# EAGLE design RPi-HAT_BUS-Controller_V0.2 (EAGLE 7.4.0)
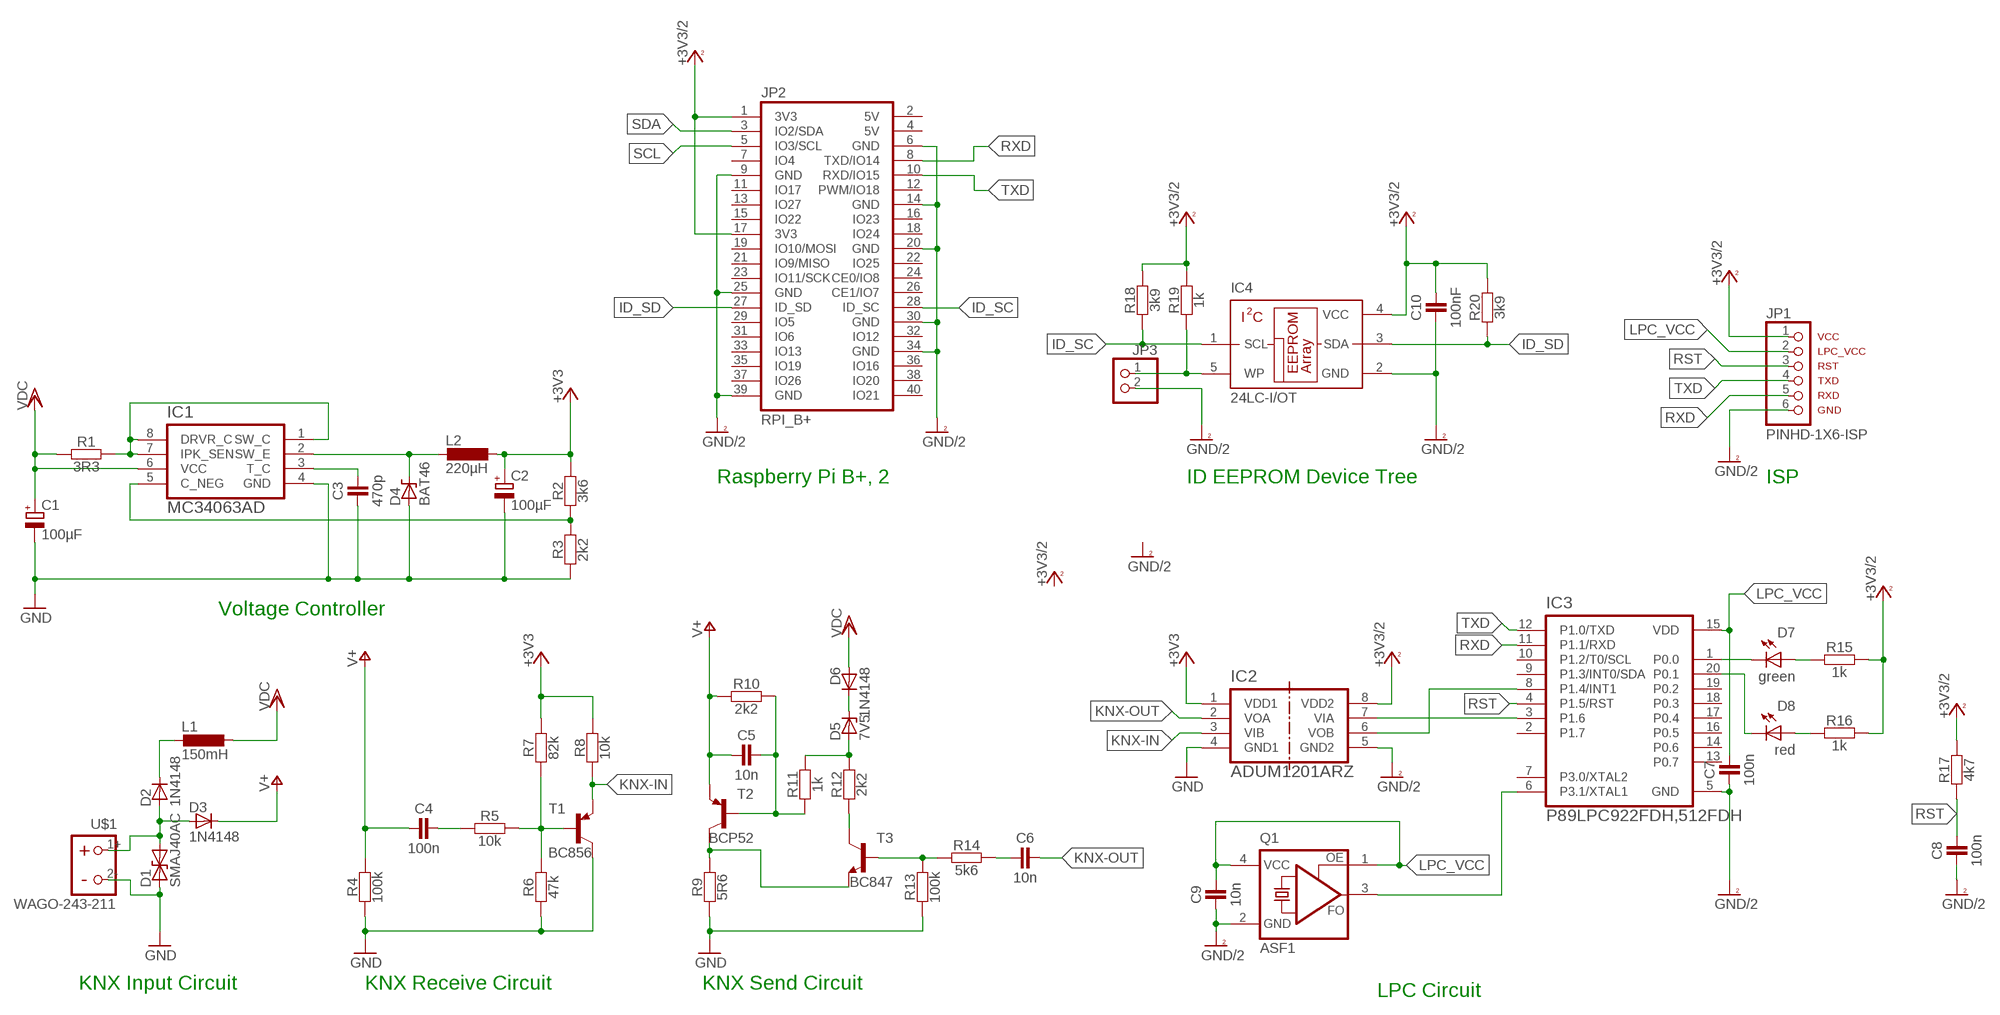
[diagram p0: schematic, sheet 1]

## Parts
C1  100µF  100µF,35V  [PANASONIC_D]
C2  100µF  100µF,6.3V  [PANASONIC_C]
C3  470p  CAPACITORC1206  [R1206]
C4  100n  CAPACITORC1206  [R1206]
C5  10n  CAPACITORC1206  [R1206]
C6  10n  CAPACITORC1206  [R1206]
C7  100n  CAPACITORC1206  [R1206]
C8  100n  CAPACITORC1206  [R1206]
C9  10n  CAPACITORC1206  [R1206]
C10  100nF  CAPACITORC1206  [R1206]
D1  SMAJ40AC  [DO-214AC]
D2  1N4148  1N4148MINIMELF  [MINIMELF]
D3  1N4148  1N4148MINIMELF  [MINIMELF]
D4  BAT46  [MINIMELF]
D5  7V5  Z-DIODE  [MINIMELF]
D6  1N4148  1N4148MINIMELF  [MINIMELF]
D7  green  LED1206  [CHIPLED_1206]
D8  red  LED1206  [CHIPLED_1206]
IC1  MC34063AD  [SOIC127P600X175-8N]
IC2  ADUM1201ARZ  [SOIC127P600X175-8N]
IC3  P89LPC922FDH,512FDH  [SOP65P640X110-20N]
IC4  24LC-I/OT  [SOT23-5]
JP1  PINHD-1X6-ISP  [1X06]
JP2  RPI_B+  [RPI-B+HAT]
JP3  PINHD-1X2  [1X02]
L1  150mH  150MH-L11PL1  [11P-L1]
L2  220µH  220µH-SMCC11.43  [2200-11.43]
Q1  ASF1  [ASF]
R1  3R3  RESISTORR1206  [R1206]
R2  3k6  RESISTORR1206  [R1206]
R3  2k2  RESISTORR1206  [R1206]
R4  100k  RESISTORR1206  [R1206]
R5  10k  RESISTORR1206  [R1206]
R6  47k  RESISTORR1206  [R1206]
R7  82k  RESISTORR1206  [R1206]
R8  10k  RESISTORR1206  [R1206]
R9  5R6  RESISTORR1206  [R1206]
R10  2k2  RESISTORR1206  [R1206]
R11  1k  RESISTORR1206  [R1206]
R12  2k2  RESISTORR1206  [R1206]
R13  100k  RESISTORR1206  [R1206]
R14  5k6  RESISTORR1206  [R1206]
R15  1k  RESISTORR1206  [R1206]
R16  1k  RESISTORR1206  [R1206]
R17  4k7  RESISTORR1206  [R1206]
R18  3k9  RESISTORR1206  [R1206]
R19  1k  RESISTORR1206  [R1206]
R20  3k9  RESISTORR1206  [R1206]
T1  BC856  PNPBC856  [SOT23]
T2  BCP52  PNPBCP52  [SOT223]
T3  BC847  NPN-BC847  [SOT23]
U$1  WAGO-243-211  [WAGO-243-211]

## Nets
+3V3: C2.+ IC2.1(VDD1) L2.1 R2.2 R7.2 R8.2
+3V3/2: C10.2 IC2.8(VDD2) IC4.4(VCC) JP1.1 JP2.1(3V3) JP2.17(3V3) R15.2 R16.2 R17.2 R18.2 R19.2 R20.2
GND: C1.- C2.- C3.1 D1.A D4.A IC1.4(GND) IC2.4(GND1) R3.1 R4.1 R6.1 R9.1 R13.1 T1.3(C) U$1.2-
GND/2: C7.1 C8.1 C9.1 C10.1 IC2.5(GND2) IC3.5(GND) IC4.2(GND) JP1.6 JP2.6(GND) JP2.9(GND) JP2.14(GND) JP2.20(GND) JP2.25(GND) JP2.30(GND) JP2.34(GND) JP2.39(GND) JP3.2 Q1.2(GND)
ID_SC: IC4.1(SCL) JP2.28(ID_SC) R18.1
ID_SD: IC4.3(SDA) JP2.27(ID_SD) R20.1
KNX-IN: IC2.3(VIB) R8.1 T1.2(E)
KNX-OUT: C6.2 IC2.2(VOA)
LPC_VCC: C7.2 C9.2 IC3.15(VDD) JP1.2 Q1.1(OE) Q1.4(VCC)
N$1: D1.C D2.A D3.A U$1.1+
N$3: IC1.5(C_NEG) R2.1 R3.2
N$4: C4.2 R5.1
N$5: D2.C L1.2
N$6: R5.2 R6.2 R7.1 T1.1(B)
N$8: IC1.1(SW_C) IC1.7(IPK_SEN) IC1.8(DRVR_C) R1.2
N$10: C3.2 IC1.3(T_C)
N$12: IC4.5(WP) JP3.1 R19.1
N$13: D4.C IC1.2(SW_E) L2.2
N$14: IC2.7(VIA) IC3.3(P1.6)
N$23: R9.2 T2.2(C) T2.4(C) T3.2(E)
N$24: C5.2 R10.2 R11.1 T2.1(B)
N$25: D5.A R11.2 R12.2
N$26: R12.1 T3.3(C)
N$28: R13.2 R14.1 T3.1(B)
N$29: C6.1 R14.2
N$31: D5.C D6.C
N$32: IC3.6(P3.1/XTAL1) Q1.3(FO)
N$33: IC2.6(VOB) IC3.8(P1.4/INT1)
N$34: D7.C IC3.1(P0.0)
N$35: D7.A R15.1
N$37: D8.C IC3.20(P0.1)
N$38: D8.A R16.1
RST: C8.2 IC3.4(P1.5/RST) JP1.3 R17.1
RXD: IC3.11(P1.1/RXD) JP1.5 JP2.8(TXD/IO14)
SCL: JP2.5(IO3/SCL)
SDA: JP2.3(IO2/SDA)
TXD: IC3.12(P1.0/TXD) JP1.4 JP2.10(RXD/IO15)
V+: C4.1 C5.1 D3.C R4.2 R10.1 T2.3(E)
VDD: C1.+ D6.A IC1.6(VCC) L1.1 R1.1 ; supply symbol labelled VDC
Unconnected: IC3.2(P1.7) IC3.7(P3.0/XTAL2) IC3.9(P1.3/INT0/SDA) IC3.10(P1.2/T0/SCL) IC3.13(P0.7) IC3.14(P0.6) IC3.16(P0.5) IC3.17(P0.4) IC3.18(P0.3) IC3.19(P0.2) JP2.2(5V) JP2.4(5V) JP2.7(IO4) JP2.11(IO17) JP2.12(PWM/IO18) JP2.13(IO27) JP2.15(IO22) JP2.16(IO23) JP2.18(IO24) JP2.19(IO10/MOSI) JP2.21(IO9/MISO) JP2.22(IO25) JP2.23(IO11/SCK) JP2.24(CE0/IO8) JP2.26(CE1/IO7) JP2.29(IO5) JP2.31(IO6) JP2.32(IO12) JP2.33(IO13) JP2.35(IO19) JP2.36(IO16) JP2.37(IO26) JP2.38(IO20) JP2.40(IO21)

## Notes on the sheet
- Raspberry Pi B+, 2 | ID EEPROM Device Tree | ISP
- Voltage Controller
- KNX Input Circuit | KNX Receive Circuit | KNX Send Circuit
- LPC Circuit

## Library data of the parts
C1 = RCL_for_Selfbus-Projects:100µF,35V: Polarized Capacitor 100µF, 35V
C2 = RCL_for_Selfbus-Projects:100µF,6.3V: Polarized Capacitor 100µF, 6.3V
C3-C10 = RCL_for_Selfbus-Projects:CAPACITOR: Capacitor
D1 = Diode:SMAJ40AC
D2 D3 = Diode:1N4148
D4 = Diode_for_Selfbus-Projects:BAT46: Schottky Diode
D5 = Diode_for_Selfbus-Projects:Z-DIODE: Z-Diode
D6 = Diode_for_Selfbus-Projects:1N4148: Diode
D7 D8 = Diode_for_Selfbus-Projects:LED: LED
IC1 = IC_for_Selfbus-Projects:MC34063A: DC/DC converter control circuit
IC2 = IC_for_Selfbus-Projects:ADUM1201ARZ: Dual-Channel Digital Isolators; MPN: ADUM1201ARZ; OC_FARNELL: 1078200; OC_NEWARK: 19M0753; PACKAGE: SOIC-8; SUPPLIER: Analog Devices
IC3 = IC_for_Selfbus-Projects:P89LPC922FDH,512: 8-bit microcontrollers with two-clock 80C51 core 2 kB/4 kB/8 kB 3 V low-power Flash with 256-byte data RAM; MPN: P89LPC922FDH,512; OC_FARNELL: 1895067; OC_NEWARK: 70R8570; PACKAGE: TSSOP-20; SUPPLIER: NXP
IC4 = IC_for_Selfbus-Projects:24LC*: Microchip I2C EEPROM 2 Kbit - 24LC02B - 24LC02BT-I/OTDKR-ND 32 Kbit- 24LC32A - 24LC32AT-I/OTDKR-ND; DIGIKEY: 24LC32AT-I/OTDKR-ND
JP1 = Connector_for_Selfbus-Projects:PINHD-1X6-ISP: PIN HEADER - ISP for Selfbus-Controller
JP2 = Connector_for_Selfbus-Projects:RPI_B+: RPi-B+ und RPi-B2 HAT
JP3 = Connector_for_Selfbus-Projects:PINHD-1X2: PIN HEADER
L1 = RCL_for_Selfbus-Projects:150MH-L11P: Inductor 150mH
L2 = RCL_for_Selfbus-Projects:220µH-SMCC: Inductor 220µH
Q1 = IC_for_Selfbus-Projects:ASF*: CRYSTAL CLOCK OSCILLATORS 5.0 Vdc or 3.3 Vdc - LOW PROFILE ULTRA MINIATURE CERAMIC SURFACE MOUNT Source: http://www.abracon.com/Oscillators/asf1-L-L1.pdf; OC_FARNELL: unknown; OC_NEWARK: unknown
R1-R20 = RCL_for_Selfbus-Projects:RESISTOR: Resistor
T1 T2 = Transistor_for_Selfbus-Projects:PNP: PNP Transistor
T3 = Transistor_for_Selfbus-Projects:NPN: NPN Transistor
U$1 = Connector_for_Selfbus-Projects:WAGO-243-211: WAGO KNX-Busklemme

## Board
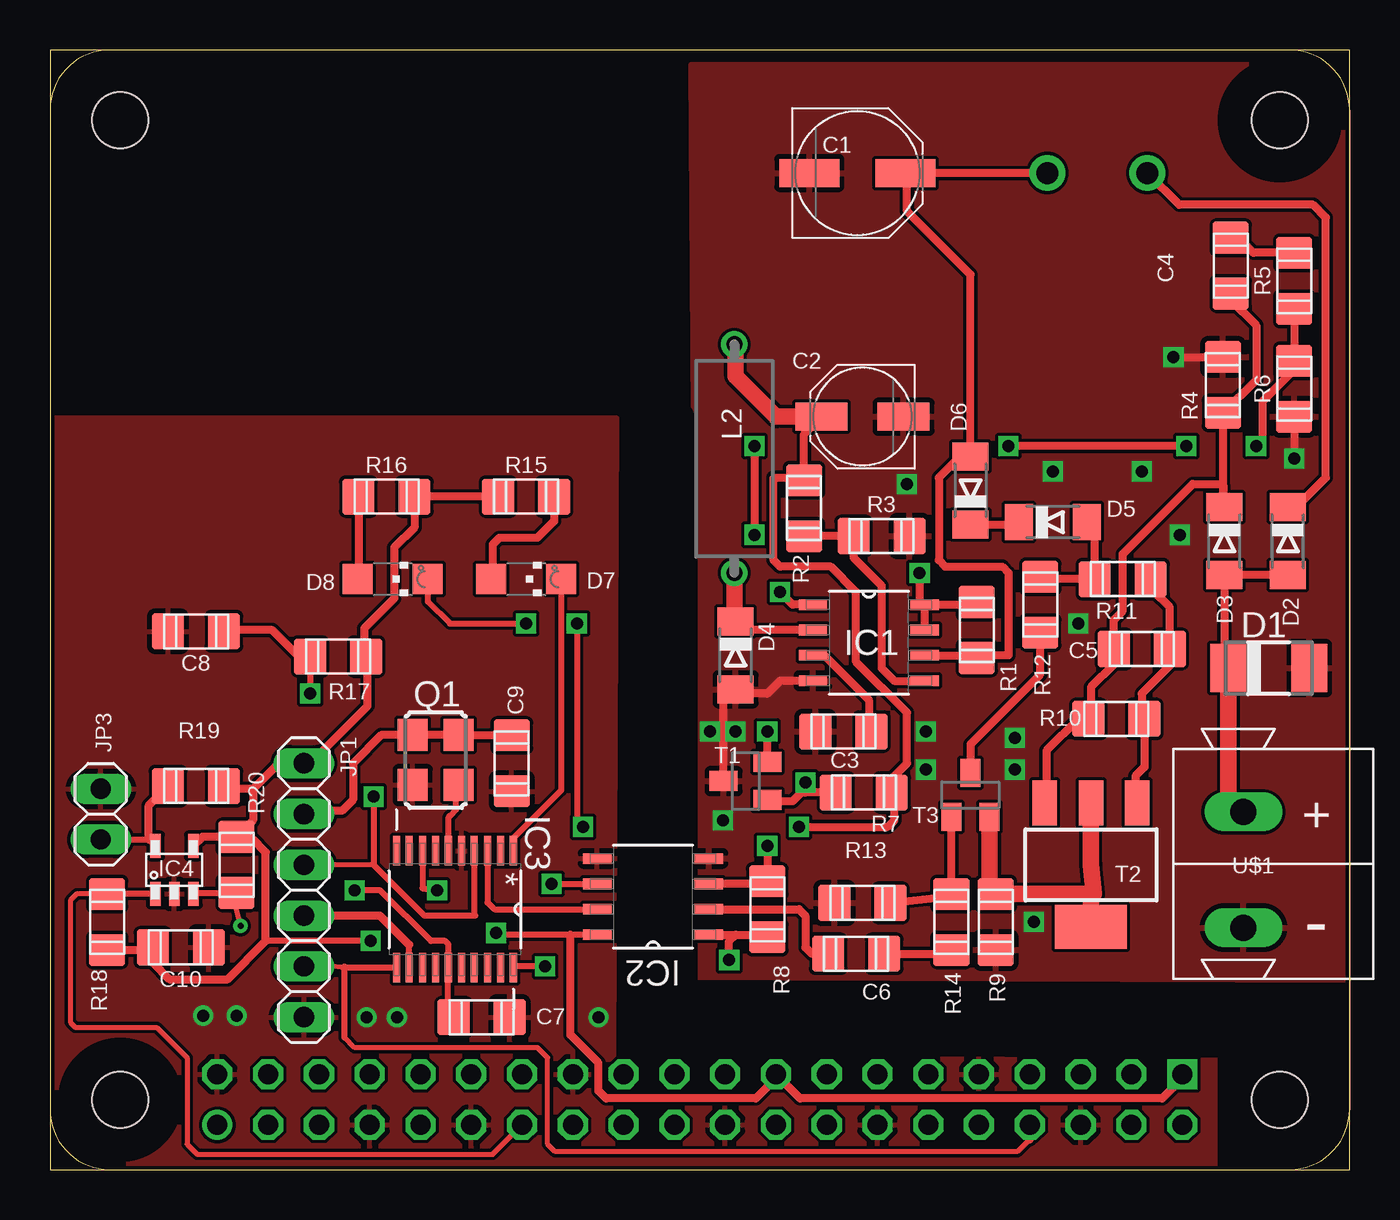
[diagram p1: board, top side]
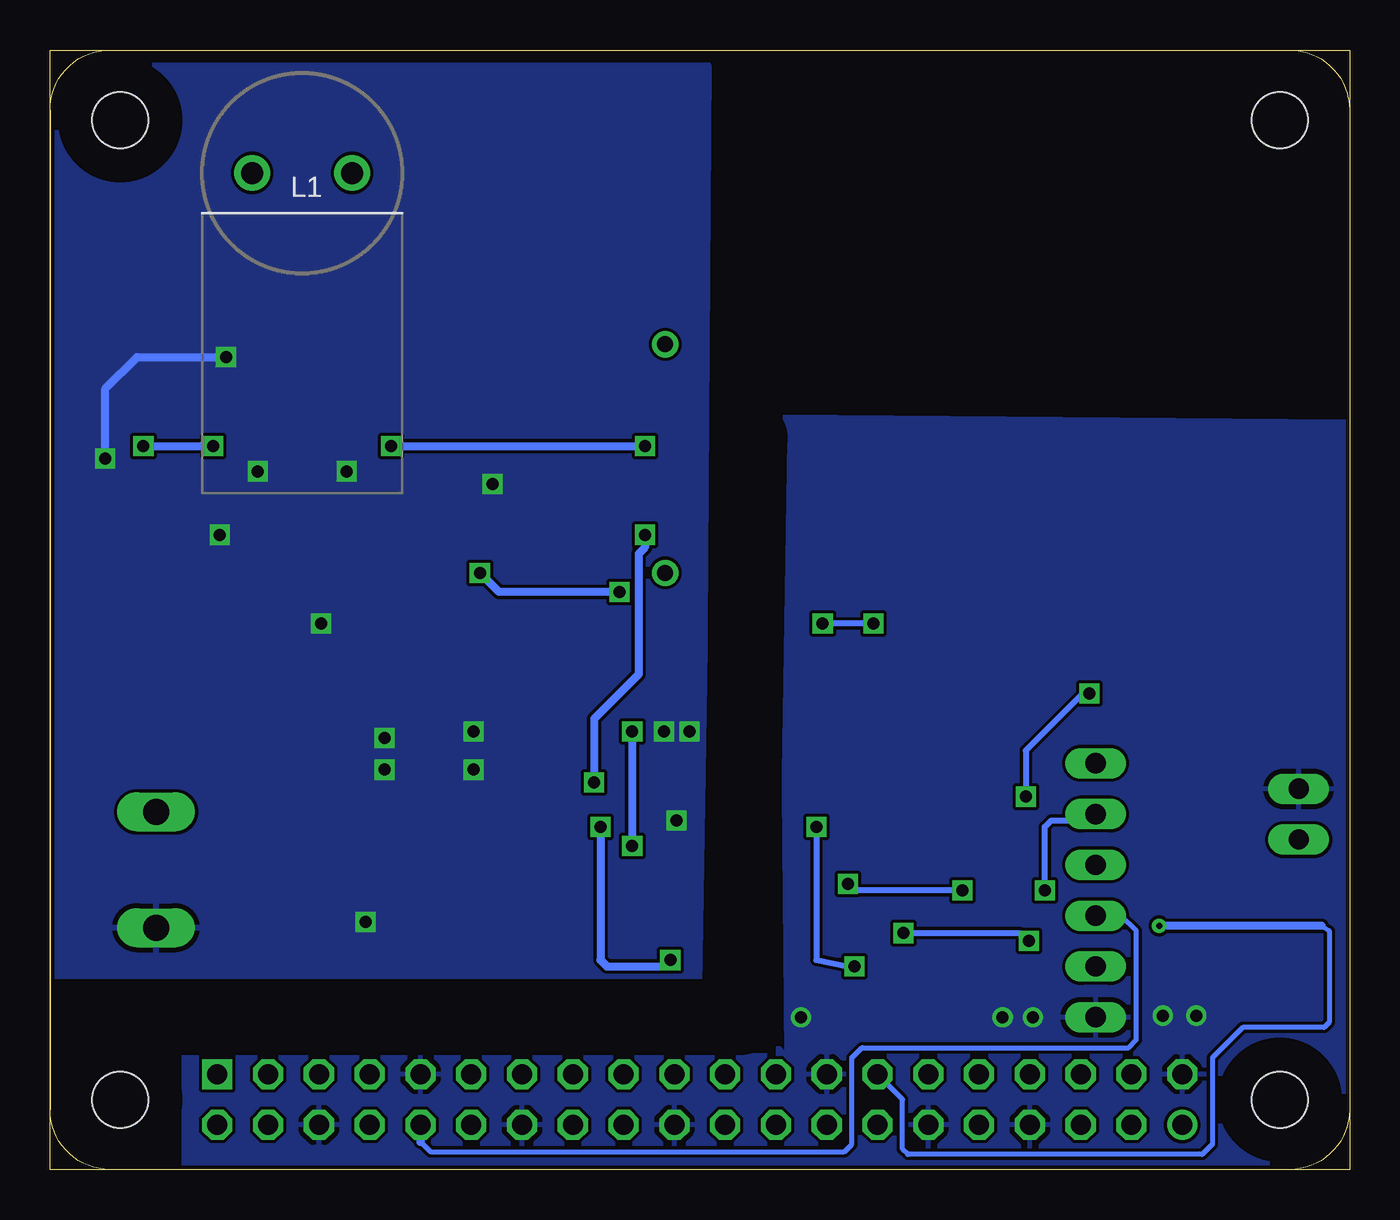
[diagram p2: board, bottom side, seen from below]

Size 65 x 56 mm. Coordinates in mm from the lower left corner, seen from the top.
Outline: 0,0 65,0 65,56 0,56 0,0
Copper layers (1*16): Top 0.035mm / dielectric 1.5mm / Bottom 0.035mm
Design rules "default *": minimum track width 8mil, minimum drill 0.3mm, track to track 6.5mil, track to pad 6.5mil, pad to pad 6.5mil, via to via 6.5mil, smd to smd 1mil, copper to edge 8mil, drill to drill 8mil, minimum pad ring 10mil, minimum via ring 8mil, stop-mask expansion 4mil, vias tented up to drill 0mil, thermal gap 10mil
tRestrict: 2 lines
bRestrict: 2 lines

### Footprints (pad centres in the part's own frame; a part is rotated, then mirrored left to right if it is on the bottom)
PANASONIC_D = smd 3 x 1.4: + 2.4,0; - -2.4,0
PANASONIC_C = smd 2.6 x 1.4: + 2.05,0; - -2.05,0
R1206 = smd 1.8 x 1.6: 1 0,1.4; 2 0,-1.4
DO-214AC = smd 1.8 x 2.4: A 2.025,0; C -2.025,0
MINIMELF = smd 1.4 x 1.8: A 1.7,0; C -1.7,0
CHIPLED_1206 = smd 1.5 x 1.5: A -1.75,0; C 1.75,0
SOIC127P600X175-8N = smd 1.422 x 0.533: 1 -2.794,1.27; 2 -2.794,0; 3 -2.794,-1.27; 4 -2.794,-2.54; 5 2.794,-2.54; 6 2.794,-1.27; 7 2.794,0; 8 2.794,1.27
SOP65P640X110-20N = smd 1.473 x 0.356: 1 -2.286,2.54; 2 -2.286,1.905; 3 -2.286,1.245; 4 -2.286,0.584; 5 -2.286,-0.051; 6 -2.286,-0.711; 7 -2.286,-1.346; 8 -2.286,-2.007; 9 -2.286,-2.667; 10 -2.286,-3.302; 11 3.556,-3.302; 12 3.556,-2.667; 13 3.556,-2.007; 14 3.556,-1.346; 15 3.556,-0.711; 16 3.556,-0.051; 17 3.556,0.584; 18 3.556,1.245; 19 3.556,1.905; 20 3.556,2.54
SOT23-5 = smd 1.2 x 0.6: 1 -1.2,0.95; 2 -1.2,0; 3 -1.2,-0.95; 4 1.2,-0.95; 5 1.2,0.95
1X06 = drill 1.016 long: 1 -6.35,0; 2 -3.81,0; 3 -1.27,0; 4 1.27,0; 5 3.81,0; 6 6.35,0
RPI-B+HAT = drill 1 square: 1 56.63,4.77 | drill 1 octagon: 2 56.63,2.23; 3 54.09,4.77; 4 54.09,2.23; 5 51.55,4.77; 6 51.55,2.23; 7 49.01,4.77; 8 49.01,2.23; 9 46.47,4.77; 10 46.47,2.23; 11 43.93,4.77; 12 43.93,2.23; 13 41.39,4.77; 14 41.39,2.23; 15 38.85,4.77; 16 38.85,2.23; 17 36.31,4.77; 18 36.31,2.23; 19 33.77,4.77; 20 33.77,2.23; 21 31.23,4.77; 22 31.23,2.23; 23 28.69,4.77; 24 28.69,2.23; 25 26.15,4.77; 26 26.15,2.23; 27 23.61,4.77; 28 23.61,2.23; 29 21.07,4.77; 30 21.07,2.23; 31 18.53,4.77; 32 18.53,2.23; 33 15.99,4.77; 34 15.99,2.23; 35 13.45,4.77; 36 13.45,2.23; 37 10.91,4.77; 38 10.91,2.23; 39 8.37,4.77 | drill 1: 40 8.37,2.23 | hole 2.8: 3.5,3.5; 3.5,52.5; 61.5,52.5; 61.5,3.5
1X02 = drill 1.016 long: 1 -1.27,0; 2 1.27,0
11P-L1 = drill 1.1 pad 1.778: 1 -2.5,0; 2 2.5,0
2200-11.43 = drill 0.8 pad 1.27: 1 -5.715,0; 2 5.715,0
ASF = smd 1.6 x 1.5: 1 -1.25,-1.15; 2 1.25,-1.15; 3 1.25,1.15; 4 -1.25,1.15
SOT23 = smd 1 x 1.4: 1 -0.95,-1.1; 2 0.95,-1.1; 3 0,1.1
SOT223 = smd 1.219 x 2.235: 1 -2.311,-3.099; 2 0,-3.099; 3 2.311,-3.099 | smd 3.6 x 2.2: 4 0,3.099
WAGO-243-211 = drill 1.3 long: 1+ 0,2.65; 2- 0,-3.15

### Placement (x,y rotation side)
C1  40.39,49.85 0 top
C2  40.64,37.66 180 top
C3  39.69,21.91 90 top
C4  59.05,45.21 180 top
C5  54.61,26.04 90 top
C6  40.32,10.79 270 top
C7  21.59,7.62 270 top
C8  7.3,26.92 90 top
C9  23.1,20.32 180 top
C10  6.54,11.11 270 top
D1  60.96,25.08 0 top
D2  61.91,31.43 270 top
D3  58.74,31.43 270 top
D4  34.29,25.72 270 top
D5  50.16,32.38 0 top
D6  46.04,33.97 90 top
D7  23.81,29.53 0 top
D8  17.14,29.53 0 top
IC1  40.96,26.99 0 top
IC2  30.16,13.02 180 top
IC3  20.64,13.65 270 top
IC4  6.22,14.99 90 top
JP1  12.7,13.97 270 top
JP2  0,0 0 top
JP3  2.54,17.78 90 top
L1  52.39,49.85 180 bottom
L2  34.23,35.56 270 top
Q1  19.29,20.48 270 top
R1  46.35,26.99 180 top
R2  37.72,33.08 180 top
R3  41.59,31.69 270 top
R4  58.67,39.24 0 top
R5  62.23,44.45 0 top
R6  62.23,39.05 180 top
R7  40.7,18.86 90 top
R8  35.88,13.02 0 top
R9  47.31,12.38 180 top
R10  53.34,22.54 90 top
R11  53.66,29.53 270 top
R12  49.53,28.26 180 top
R13  40.64,13.34 90 top
R14  45.09,12.38 0 top
R15  23.81,33.66 270 top
R16  16.83,33.66 90 top
R17  14.41,25.65 90 top
R18  2.86,12.38 0 top
R19  7.3,19.18 90 top
R20  9.33,15.24 180 top
T1  34.8,19.43 90 top
T2  52.07,15.24 180 top
T3  46.04,18.73 0 top
U$1  59.69,15.24 0 top

### Tracks (layer width: path | path; a pad name or v marks a point on that pad's centre or on a via)
+3V3  (via drill 0.6)
  Top 0.406: C2.+ 37.72,36.78 R2.2 37.59,34.61 36.2,34.61 36.2,30.48 36.51,30.16 39.05,30.16 40.32,28.89 40.32,25.4 42.86,22.86 42.86,20.32 42.1,19.56 R7.2 42.23,18.73 42.23,17.46 41.91,17.14 v37.47,17.14 | IC2.1 34.29,11.75 | 34.29,11.75 35.62,11.75 R8.2 | v33.97,10.48 33.97,11.43 34.29,11.75
  Top 0.813: C2.+ 36.32,37.66 34.29,39.69 34.29,41.21 L2.1
  Bottom 0.406: v37.47,17.14 37.47,10.48 37.15,10.16 34.29,10.16 v33.97,10.48
+3V3/2  (via drill 0.6)
  Top 0.305: IC2.8 26.04,11.75 22.49,11.75 arc-45 v22.31,11.82 v22.3,11.83 | v16.03,11.43 10.79,11.43
  Top 0.406: 10.16,19.05 11.43,20.32 JP1.1 13.21,20.83 13.53,20.83 15.88,23.18 15.88,25.59 R17.2 15.72,25.75 15.72,27.07 17.22,28.57 17.22,31.11 18.23,32.12 R16.2 R15.2 | 10.16,19.05 10.16,17.46 R20.2 | R20.2 7.63,16.64 IC4.4 | R18.2 5.01,10.98 C10.2 5.14,10.35 5.97,9.53 8.89,9.53 10.79,11.43 10.79,15.88 10.16,16.51 9.46,16.51 R20.2 | JP2.1 56.63,4.56 55.63,3.56 37.52,3.56 JP2.17 36.31,4.56 35.31,3.56 27.81,3.56 27.43,3.94 27.43,5.33 26.04,6.73 26.04,11.75 | 10.16,19.05 8.83,19.05 R19.2
  Bottom 0.305: v22.3,11.83 16.54,11.83 arc45 16.36,11.75 v16.03,11.43
GND  (via drill 0.6)
  Top 0.406: IC1.4 36.51,24.45 35.88,23.81 34.49,23.81 D4.A 33.7,23.43 T1.3 | R6.1 v62.23,35.56 | v56.2,40.64 R4.1
  Bottom 0.406: v62.23,35.56 62.23,39.05 60.64,40.64 v56.2,40.64
  other vias: 54.61,34.92 50.16,34.92 51.44,27.3 56.52,31.75 42.86,34.29 48.26,21.59 33.02,21.91 34.29,21.91 33.66,17.46 48.26,20 43.81,20 43.81,21.91 49.21,12.38
  pour Bottom: 32.38,9.53 65.02,9.53 65.02,9.65 64.71,55.24 32.07,55.24
  pour Top: 32.38,9.53 65.02,9.53 64.71,55.24 32.07,55.24
GND/2  (via drill 0.6)
  other vias: 27.43,7.62 17.35,7.62 15.84,7.62 9.33,7.7 7.67,7.7
  pour Bottom: 28.45,37.66 0.24,37.42 0,22.61 0,0 58.29,0 58.29,5.71 28.57,5.71 28.57,6.1 28.13,5.62
  pour Top: 28.37,37.58 0.16,37.58 0,-0.13 58.29,-0.13 58.29,5.71 28.21,5.71
ID_SC
  Top 0.254: JP2.28 22.14,0.76 7.37,0.76 6.86,1.27 6.86,5.59 5.33,7.11 1.27,7.11 1.02,7.37 1.02,13.46 1.34,13.78 R18.1
  Top 0.305: IC4.1 R18.1
ID_SD  (via drill 0.3)
  Top 0.254: v9.53,12.19 9.34,13.02 R20.1
  Top 0.305: IC4.3 7.23,13.84 R20.1
  Bottom 0.254: JP2.27 22.35,3.51 22.35,1.02 22.1,0.76 7.37,0.76 6.86,1.27 6.86,5.59 5.33,7.11 1.27,7.11 1.02,7.37 1.02,11.94 1.4,12.19
  Bottom 0.406: 1.4,12.19 v9.53,12.19
KNX-IN  (via drill 0.6)
  Top 0.406: IC2.3 35.24,14.29 35.5,14.54 R8.1 v35.88,16.19 | T1.2 35.9,21.89 v35.88,21.91
  Bottom 0.406: v35.88,21.91 v35.88,16.19
KNX-OUT
  Top 0.406: IC2.2 37.47,13.02 37.78,12.7 37.78,11.11 38.1,10.79 C6.2
LPC_VCC  (via drill 0.6)
  Top 0.305: v15.24,13.97 16.51,13.97 19.05,11.43 19.76,11.43 19.93,11.27 IC3.15 19.92,10.02 19.92,8.41 20.19,8.15 C7.2
  Top 0.406: C9.2 Q1.4 Q1.1 16.57,21.73 15.16,20.32 15.16,18.49 14.61,17.94 12.86,17.94 JP1.2
  Bottom 0.305: v15.24,13.97 15.24,17.14 14.92,17.46 13.02,17.46 JP1.2
N$1
  Top 0.406: D2.A D3.A 58.74,25.28 D1.C
  Top 0.813: D1.C 58.94,18.64 U$1.1+
N$3
  Top 0.406: R2.1 R3.2 40.19,30.61 41.59,29.21 41.59,25.08 42.23,24.45 IC1.5
N$4
  Top 0.406: R5.1 60.2,45.85 59.69,46.35 59.31,46.35 C4.2
N$5
  Top 0.406: D2.C 62.34,33.13 63.82,34.61 63.82,47.62 63.18,48.26 56.48,48.26 L1.2
N$6  (via drill 0.6)
  Top 0.406: R7.1 37.78,18.86 | 37.78,18.86 37.59,18.86 37.15,18.41 35.96,18.41 T1.1 | R5.2 R6.2 62.23,40.01 60.64,38.42 60.64,36.51 v60.33,36.2 | v56.83,36.2 v47.94,36.2 | v37.78,19.37 37.78,18.86 | v35.24,36.2 v35.24,31.75
  Bottom 0.406: v60.33,36.2 v56.83,36.2 | v47.94,36.2 v35.24,36.2 | v35.24,31.75 35.24,31.11 35.56,30.8 35.56,24.77 37.78,22.54 v37.78,19.37
N$8  (via drill 0.6)
  Top 0.406: IC1.8 46.54,28.26 R1.2 | IC1.7 IC1.8 | IC1.1 37.15,28.26 v36.51,28.89 | v43.5,29.84 43.5,28.51 IC1.8
  Bottom 0.406: v36.51,28.89 42.55,28.89 v43.5,29.84
N$10
  Top 0.406: IC1.3 38.73,25.72 40.96,23.5 40.96,22.04 C3.2
N$12
  Top 0.305: JP3.1 4.95,16.51 IC4.5
  Top 0.406: 4.95,16.51 4.95,18.22 R19.1
N$13
  Top 0.406: IC1.2 34.72,26.99 D4.C
  Top 0.813: D4.C 34.23,27.42 L2.2
N$14
  Top 0.305: IC3.3 21.88,13.36 22.23,13.02 IC2.7
N$23
  Top 0.813: 52.07,13.78 R9.2 46.99,14.1 T3.2 | 52.07,13.78 52.2,13.78 52.07,15.24 T2.2 | T2.4 52.07,13.78
N$24
  Top 0.406: T2.1 54.29,18.43 54.29,19.68 54.74,20.13 R10.2 54.61,22.67 54.61,23.81 56.01,25.21 C5.2 56.01,28.13 55.24,28.89 55.24,29.34 R11.1
N$25
  Top 0.406: D5.A 52.26,31.99 R11.2 49.66,29.53 R12.2
N$26
  Top 0.406: 46.04,19.68 T3.3 46.04,21.27 49.53,24.77 R12.1
N$28
  Top 0.406: R13.2 44.95,13.65 R14.1 45.09,16.04 T3.1
N$29
  Top 0.406: C6.1 44.9,10.79 R14.2
N$31
  Top 0.406: D6.C 48.35,32.27 D5.C
N$32
  Top 0.305: IC3.6 19.93,17.52 arc-45 20,17.7 20.32,18.02 20.32,19 arc-45 20.39,19.18 Q1.3
N$33  (via drill 0.6)
  Top 0.305: IC3.8 18.63,14.07 v19.37,13.97 | v25.08,14.29 IC2.6
  Bottom 0.305: v19.37,13.97 24.77,13.97 v25.08,14.29
N$34
  Top 0.305: D7.C 25.56,18.97 23.18,16.59 IC3.1
N$35
  Top 0.406: R15.1 25.21,32.44 24.37,31.59 22.46,31.59 22.15,31.27 22.15,29.61 D7.A
N$37  (via drill 0.6)
  Top 0.305: D8.C 18.89,28.41 20,27.3 v23.81,27.3 | v26.35,27.3 26.35,17.46 v26.67,17.14 | v24.77,10.16 23.24,10.16 IC3.20
  Bottom 0.305: v23.81,27.3 v26.35,27.3 | v26.67,17.14 26.67,10.48 25.08,10.16 v24.77,10.16
N$38
  Top 0.406: R16.1 15.43,29.56 D8.A
RST  (via drill 0.6)
  Top 0.254: 16.19,15.24 JP1.3
  Top 0.305: IC3.4 21.22,12.75 21.27,12.7 18.73,12.7 16.19,15.24 v16.19,18.65 | 12.45,25.65 R17.1 13.01,24.77 v13.02,23.81
  Top 0.406: 12.45,25.65 11.11,26.99 8.77,26.99 C8.2
  Bottom 0.305: v13.02,23.81 13.02,24.13 16.03,21.11 16.19,20.95 v16.19,18.65
RXD
  Top 0.254: 49.01,1.51 48.39,0.89 25.27,0.89 24.89,1.27 24.89,5.59 24.38,6.1 15.24,6.1 14.73,6.6 | 14.73,10.11 13.97,10.16 JP1.5
  Top 0.305: 14.73,6.6 14.73,10.08 14.73,10.11 | IC3.11 14.72,10.1
  Top 0.406: 14.72,10.1 14.73,10.08 | 49.01,1.51 JP2.8
TXD
  Top 0.305: IC3.12 17.97,11.24
  Top 0.406: 17.97,11.24 16.51,12.7 JP1.4
  Bottom 0.254: 46.47,1.39 45.97,0.89 25.27,0.89 24.89,1.27 24.89,5.59 24.38,6.1 11.05,6.1 10.67,6.48 10.67,11.94 11.43,12.7 JP1.4
  Bottom 0.406: JP2.10 46.47,1.39
V+
  Top 0.406: T2.3 49.85,18.43 49.85,20.95 51.44,22.54 R10.1 52.07,22.67 52.07,24.13 53.21,25.27 C5.1 53.21,27.49 53.66,27.94 53.66,30.8 57.15,34.29 58.62,34.29 D3.C 58.67,34.47 R4.2 60.33,39.49 60.33,42.23 59.05,43.5 C4.1
VDD
  Top 0.406: L1.1 44.13,49.85 43.81,50.16 43.1,50.16 C1.+ 42.86,49.77 42.86,47.94 46.04,44.77 D6.A 45.52,35.67 44.45,34.61 44.45,30.48 44.77,30.16 47.62,30.16 47.94,29.84 47.94,25.72 46.8,25.72 R1.1 46.54,25.72 IC1.6